# EAGLE design openautov1point2 (EAGLE 8.3.1)
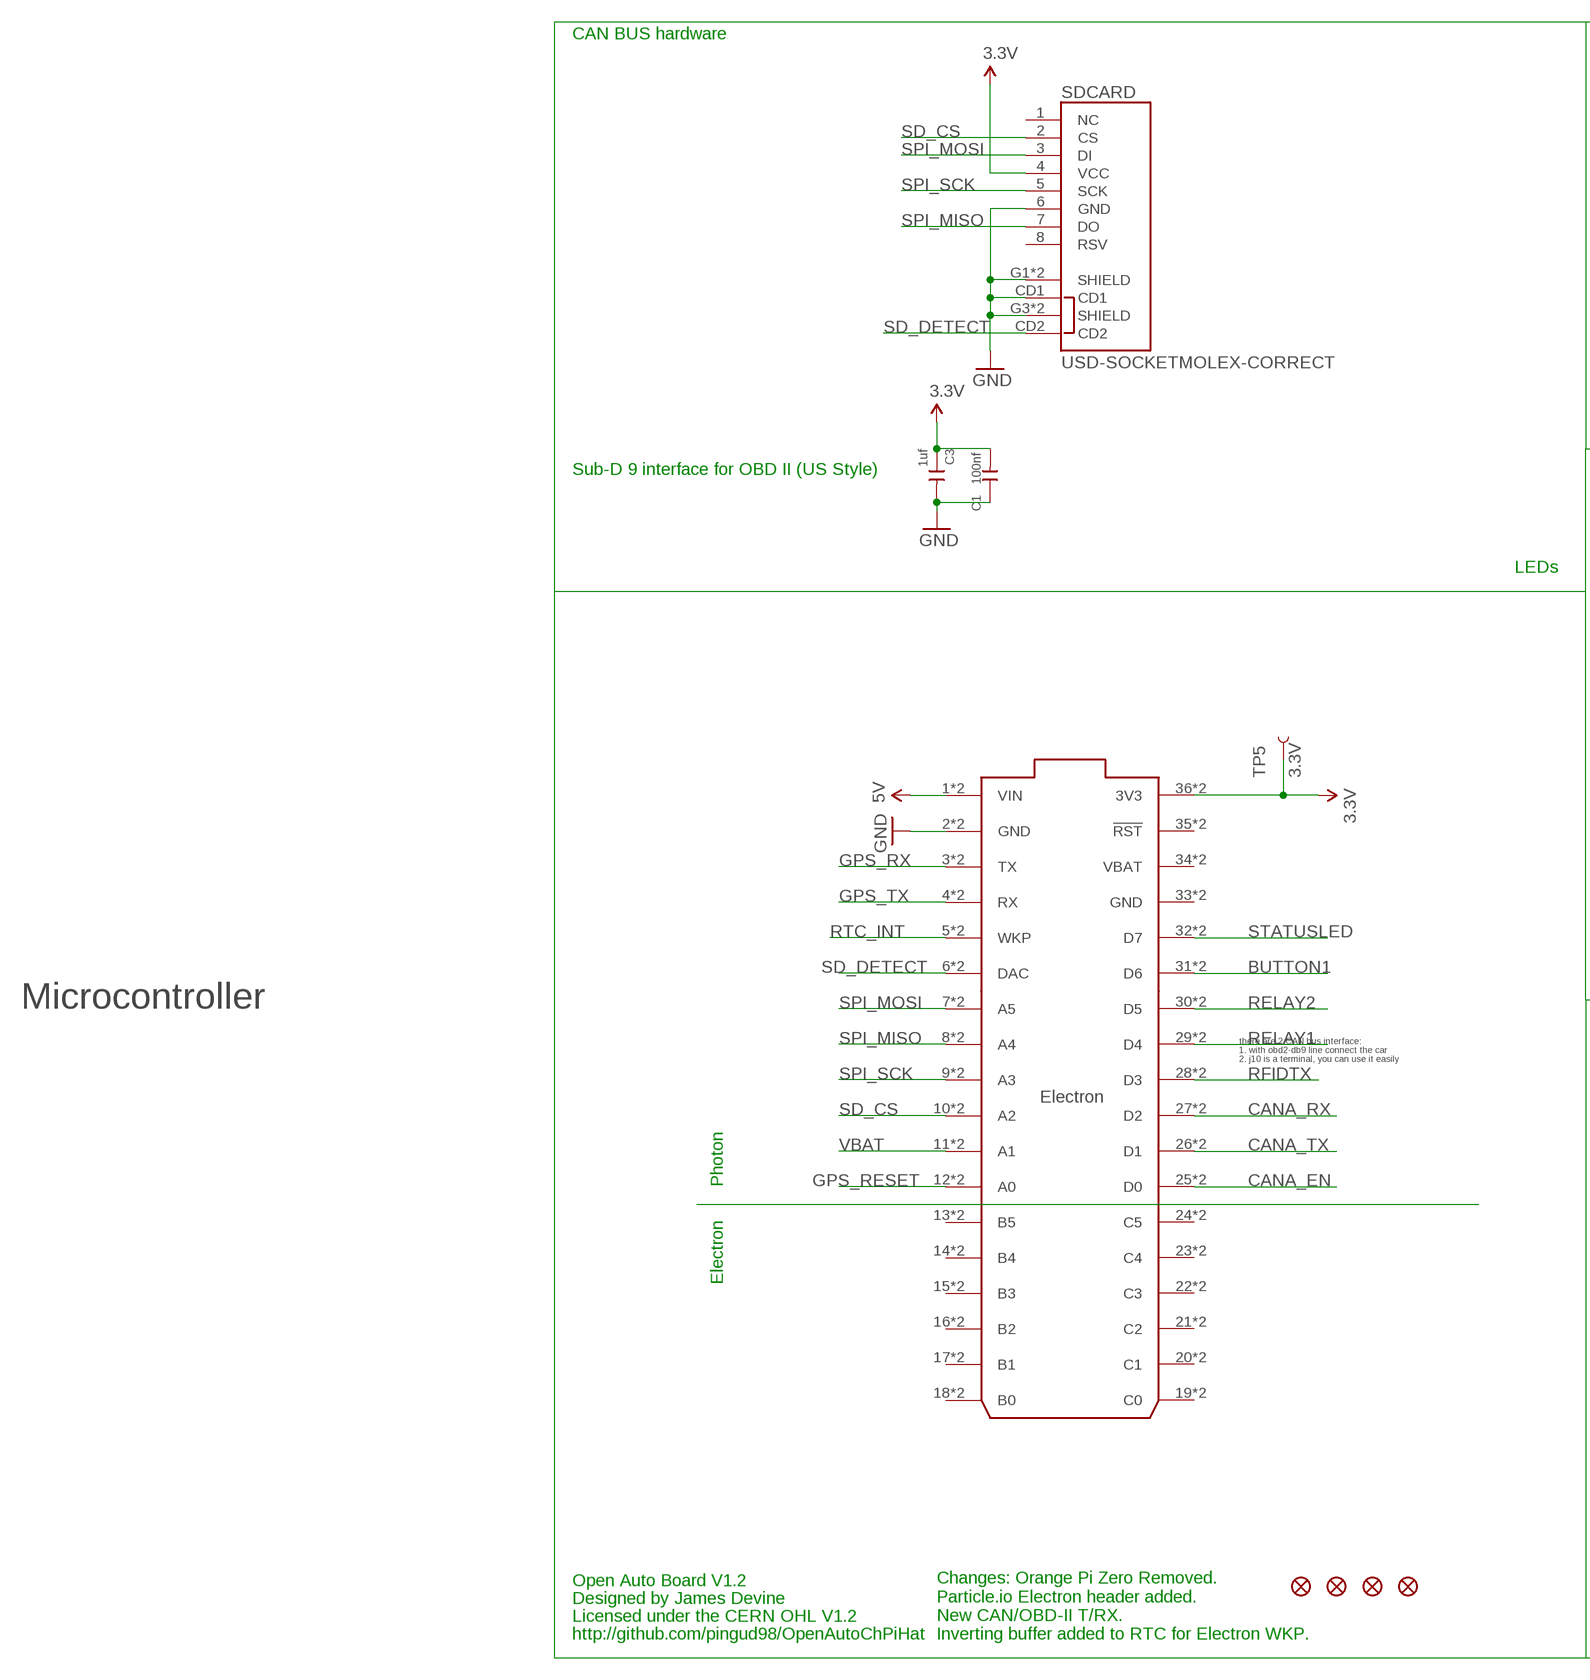
[diagram p0: schematic, sheet 1, part 1 of 2]
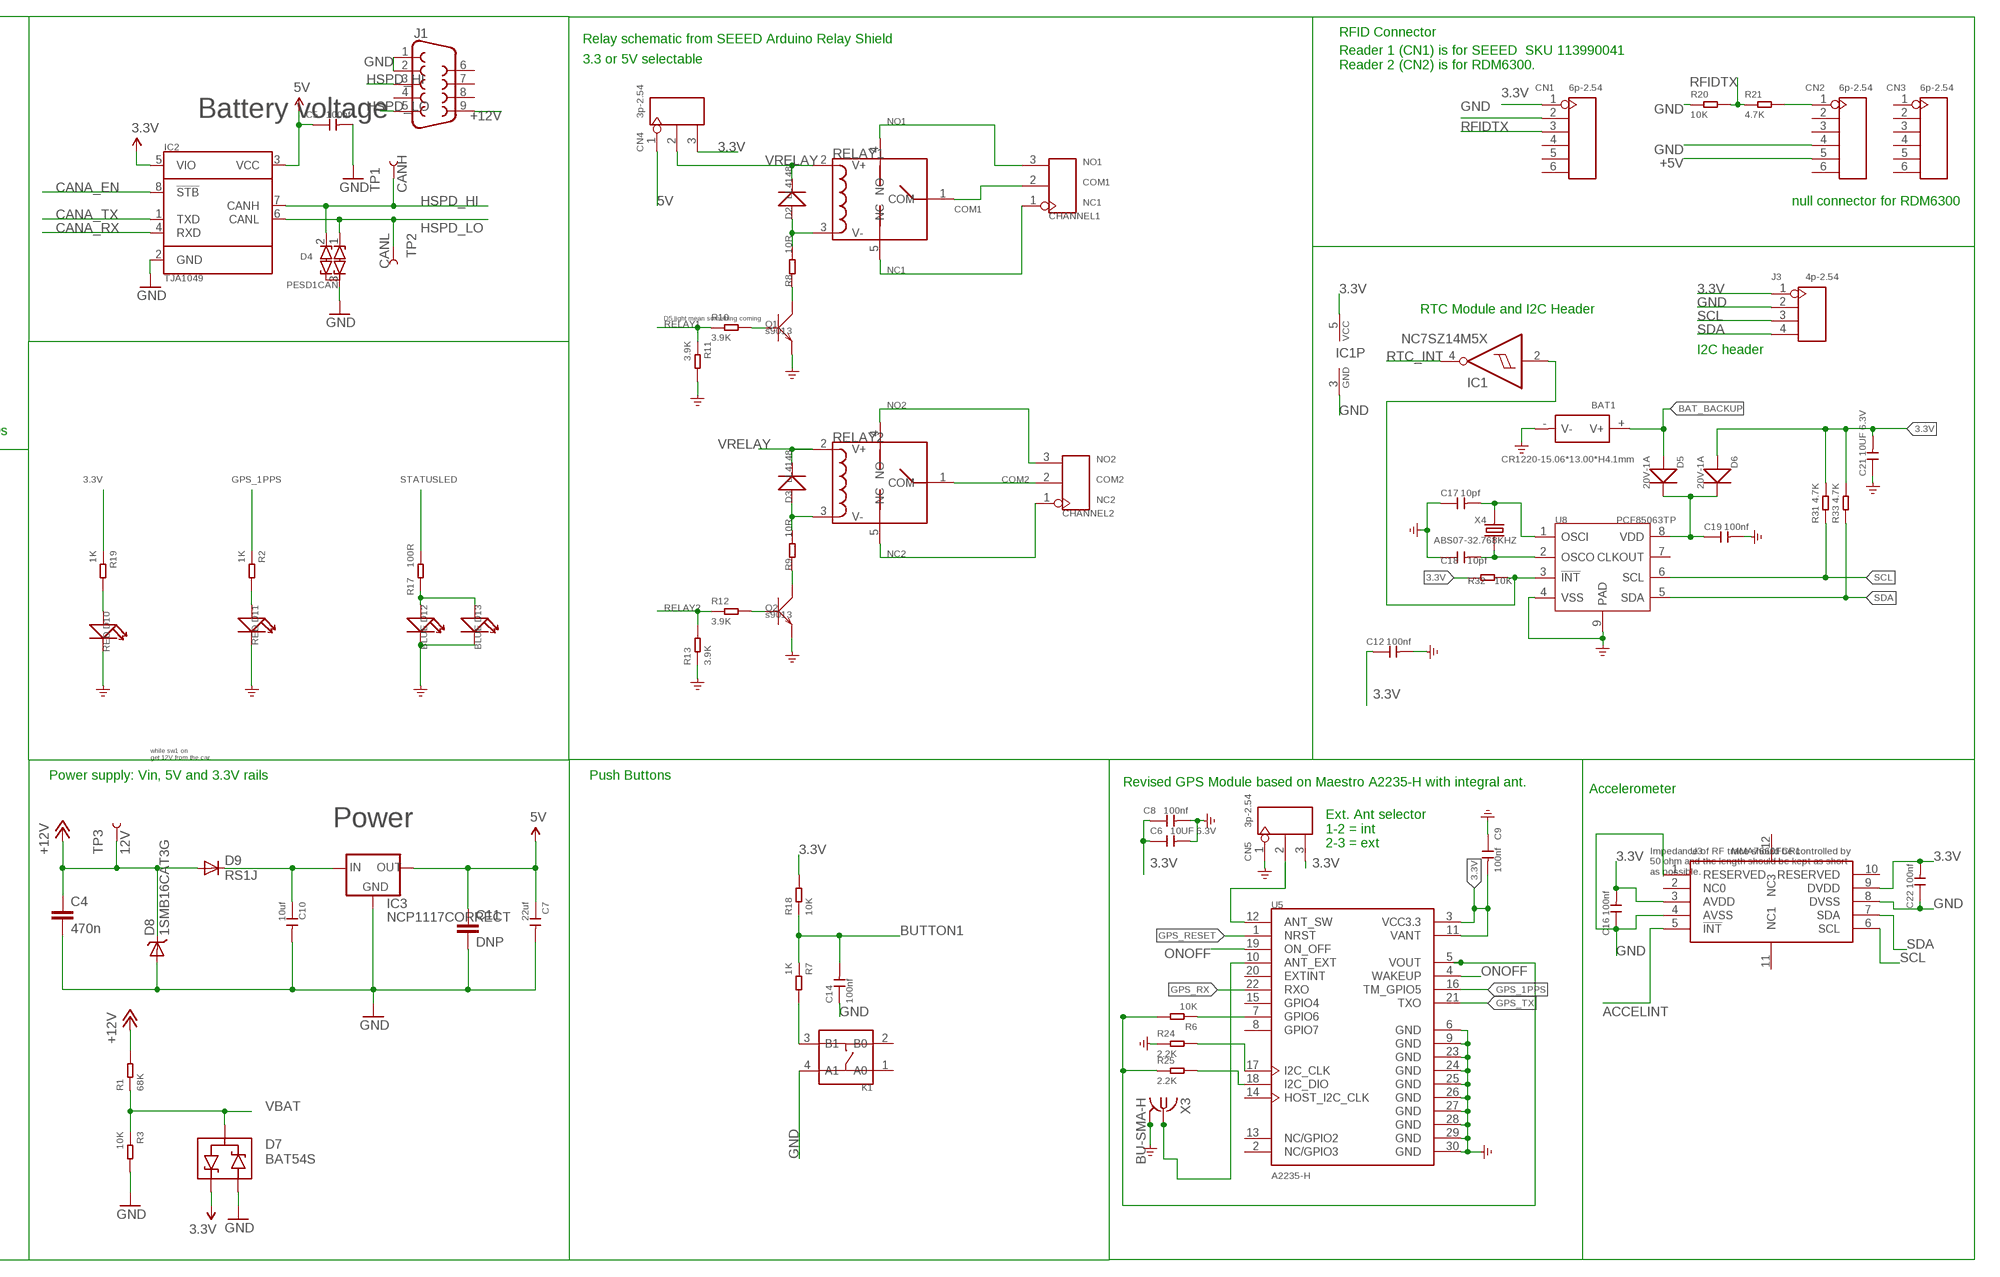
[diagram p1: schematic, sheet 1, part 2 of 2]

## Parts
BAT1  CR1220-15.06*13.00*H4.1mm  BAT-HOLDER'SMD-1220'  [BAT2P-SMD-16.4-CR1220]
C1  100nf  CERAMIC-100NF-50V-10%-X7R(0603)  [C0603]
C3  1uf  CERAMIC-1UF-25V-10%-X7R(0603)  [C0603]
C4  470n  C-EUC0805  [C0805]
C5  100nf  CERAMIC-100NF-50V-10%-X7R(0603)  [C0603]
C6  10UF 6.3V  CERAMIC-10UF-6.3V-20%-X5R(0603)  [C0603]
C7  22uf  CERAMIC-22UF-6.3V-20%-X5R(0805)  [C0805]
C8  100nf  CERAMIC-100NF-50V-10%-X7R(0603)  [C0603]
C9  100nf  CERAMIC-100NF-50V-10%-X7R(0603)  [C0603]
C10  10uf  CERAMIC-10UF-25V-10%-X5R(0805)  [C0805]
C11  DNP  C-EUC0805  [C0805]
C12  100nf  CERAMIC-100NF-50V-10%-X7R(0603)  [C0603]
C14  100nf  CERAMIC-100NF-50V-10%-X7R(0603)  [C0603]
C16  100nf  CERAMIC-100NF-50V-10%-X7R(0603)  [C0603]
C17  10pf  CERAMIC-10PF-50V-5%-NPO(0603)  [C0603]
C18  10pf  CERAMIC-10PF-50V-5%-NPO(0603)  [C0603]
C19  100nf  CERAMIC-100NF-50V-10%-X7R(0603)  [C0603]
C21  10UF 6.3V  CERAMIC-10UF-6.3V-20%-X5R(0603)  [C0603]
C22  100nf  CERAMIC-100NF-50V-10%-X7R(0603)  [C0603]
CHANNEL1  SCREW-TERMINAL-3P'3.5'  [3P-3.5]
CHANNEL2  SCREW-TERMINAL-3P'3.5'  [3P-3.5]
CN1  6p-2.54  DIP-BLACK-FEMALE-HEADER-VERT(6P-2.54)  [H6-2.54]
CN2  6p-2.54  DIP-BLACK-FEMALE-HEADER-VERT(6P-2.54)  [H6-2.54]
CN3  6p-2.54  DIP-BLACK-FEMALE-HEADER-VERT(6P-2.54)  [H6-2.54]
CN4  3p-2.54  DIP-BLACK-MALE-HEADER-VERT(3P-2.54)  [H3-2.54]
CN5  3p-2.54  DIP-BLACK-MALE-HEADER-VERT(3P-2.54)  [H3-2.54]
D2  LL4148  D'1N4148-SMD'  [LL-34]
D3  LL4148  D'1N4148-SMD'  [LL-34]
D4  PESD1CAN  DIODE_ESD_DUAL-SOT-23  [SOT23]
D5  20V-1A  SMD-DIODE-SCHOTTKY-20V-1A(SOD-123)  [SOD-123]
D6  20V-1A  SMD-DIODE-SCHOTTKY-20V-1A(SOD-123)  [SOD-123]
D7  BAT54S  [SOT23]
D8  1SMB16CAT3G  DIODE-TVS-SMB  [SMB-DIODE]
D9  RS1J  DIODESMA  [SMA-DIODE]
D10  RED  LED'0603'  [LED-0603]
D11  RED  LED'0603'  [LED-0603]
D12  BLUE  LED'0603'  [LED-0603]
D13  BLUE  LED'0603'  [LED-0603]
ELECTRON  ELECTRON_WITH_EXTERNAL_HEADERS  [ELECTRON_EXTERNAL]
FID1  FIDUCIAL1.5X3  [FIDUCIAL-1.5X3]
FID2  FIDUCIAL1.5X3  [FIDUCIAL-1.5X3]
FID3  FIDUCIAL1.5X3  [FIDUCIAL-1.5X3]
FID4  FIDUCIAL1.5X3  [FIDUCIAL-1.5X3]
IC1  NC7SZ14M5X  [SOT23-5]
IC2  TJA1049  [SO8]
IC3  NCP1117CORRECT  [SOT223]
J1  DB9MALE  [DB9_MALE]
J3  4p-2.54  DIP-BLACK-FEMALE-HEADER-VERT(4P-2.54)  [H4-2.54]
K1  DIP-SWITCH-TACTILE-SPST-NO/TS-1109(4P-D6.0MM)'TS-1109'  [SW4-6.0X6.0X5.0MM]
Q1  s9013  TRANSISTOR-NPN-SOT23  [SOT23]
Q2  s9013  TRANSISTOR-NPN-SOT23  [SOT23]
R1  68K  SMD-RES-68K-1%-1/10W(0603)  [R0603]
R2  1K  SMD-RES-1K-1%-1/10W(0603)  [R0603]
R3  10K  SMD-RES-10K-5%-1/10W(0603)  [R0603]
R6  10K  SMD-RES-10K-5%-1/10W(0603)  [R0603]
R7  1K  SMD-RES-1K-1%-1/10W(0603)  [R0603]
R8  10R  R-0603  [R0603]
R9  10R  R-0603  [R0603]
R10  3.9K  SMD-RES-3.9K-5%-1/10W(0603)  [R0603]
R11  3.9K  SMD-RES-3.9K-5%-1/10W(0603)  [R0603]
R12  3.9K  SMD-RES-3.9K-5%-1/10W(0603)  [R0603]
R13  3.9K  SMD-RES-3.9K-5%-1/10W(0603)  [R0603]
R17  100R  SMD-RES-100R-5%-1/10W(0603)  [R0603]
R18  10K  SMD-RES-10K-5%-1/10W(0603)  [R0603]
R19  1K  SMD-RES-1K-1%-1/10W(0603)  [R0603]
R20  10K  SMD-RES-10K-5%-1/10W(0603)  [R0603]
R21  4.7K  SMD-RES-4.7K-5%-1/10W(0603)  [R0603]
R24  2.2K  SMD-RES-2.2K-5%-1/10W(0603)  [R0603]
R25  2.2K  SMD-RES-2.2K-5%-1/10W(0603)  [R0603]
R31  4.7K  SMD-RES-4.7K-5%-1/10W(0603)  [R0603]
R32  10K  SMD-RES-10K-5%-1/10W(0603)  [R0603]
R33  4.7K  SMD-RES-4.7K-5%-1/10W(0603)  [R0603]
RELAY1  RELAY-HLS8L-DC5V-S-C  [5P-19.0X15.5X15.8H]
RELAY2  RELAY-HLS8L-DC5V-S-C  [5P-19.0X15.5X15.8H]
SDCARD  USD-SOCKETMOLEX-CORRECT  [MICRO-SD-MOLEX-CORRECT]
TP1  CANH  TEST-POINT3  [PAD.03X.03]
TP2  CANL  TEST-POINT3  [PAD.03X.03]
TP3  12V  TEST-POINT3  [PAD.03X.03]
TP5  3.3V  TEST-POINT3  [PAD.03X.03]
U3  MMA7660FCR1  MOTION/POSITION-MMA7660FCR1(DFN10)  [DFN10-0.5-3.0X3.0MM]
U5  A2235-H  [XCVR_A2235-H]
U8  PCF85063TP  RTC-PCF85063TP  [HWSON8-0.5-2X3X0.75MM]
X3  BU-SMA-H  [BU-SMA-H]
X4  ABS07-32.768KHZ  CRYSTAL-2P-3215  [X2-SMD-3.2X1.5X0.55MM]

## Nets
3.3V: C1.2 C3.1 C6.1 C8.1 C9.2 C12.1 C16.2 C21.2 C22.2 CN1.1 CN4.3 D6.+ D7.2(C1) ELECTRON.36(3V3) ELECTRON.@36(3V3) IC1.5(VCC) IC2.5(VIO) J3.1 R18.2 R19.1 R31.2 R32.1 R33.2 SDCARD.4(VCC) TP5.P$1 U3.3(AVDD) U3.9(DVDD) U5.3(VCC3.3) U5.11(VANT)
5V [power]: C5.1 C7.1 C11.1 CN4.1 ELECTRON.1(VIN) ELECTRON.@1(VIN) IC2.3(VCC) IC3.2(OUT) IC3.4(OUT)
!RTC_INT: IC1.2(I) R32.2 U8.3(!INT)
+5V [5V Line]: CN2.5
+12V [power]: C4.1 D8.C D9.A J1.9 R1.2 TP3.P$1
ACCELINT: U3.5(!INT)
BAT_BACKUP: BAT1.+(V+) D5.+
BUTTON1: C14.2 ELECTRON.31(D6) ELECTRON.@31(D6) R7.1 R18.1
CANA_EN: ELECTRON.25(D0) ELECTRON.@25(D0) IC2.8(!STB)
CANA_RX: ELECTRON.27(D2) ELECTRON.@27(D2) IC2.4(RXD)
CANA_TX: ELECTRON.26(D1) ELECTRON.@26(D1) IC2.1(TXD)
COM1: CHANNEL1.2 RELAY1.1(COM)
COM2: CHANNEL2.2 RELAY2.1(COM)
GND [power]: BAT1.-(V-) C1.1 C3.2 C4.2 C5.2 C6.2 C7.2 C8.2 C9.1 C10.2 C11.2 C12.2 C14.1 C16.1 C17.1 C18.1 C19.2 C21.1 C22.1 CN1.2 CN2.4 CN5.1 D4.3(COM) D7.1(A2) D8.A D10.- D11.- D12.- D13.- ELECTRON.2(GND) ELECTRON.@2(GND) IC1.3(GND) IC2.2(GND) IC3.1(GND) J1.1 J1.2 J3.2 K1.4(A1) Q1.2(E) Q2.2(E) R3.2 R11.2 R13.1 R20.1 R24.1 SDCARD.6(GND) SDCARD.CD1 SDCARD.G1(SHIELD) SDCARD.G2(SHIELD) SDCARD.G3(SHIELD) SDCARD.G4(SHIELD) U3.1(RESERVED) U3.4(AVSS) U3.8(DVSS) U5.6(GND) U5.9(GND) U5.23(GND) U5.24(GND) U5.25(GND) U5.26(GND) U5.27(GND) U5.28(GND) U5.29(GND) U5.30(GND) U8.4(VSS) U8.9(PAD) X3.2 X3.3 X3.4 X3.5 ; supply symbol labelled GND_POWER
GPS_1PPS: R2.1 U5.16(TM_GPIO5)
GPS_RESET: ELECTRON.12(A0) ELECTRON.@12(A0) U5.1(NRST)
GPS_RX: ELECTRON.3(TX) ELECTRON.@3(TX) U5.22(RXO)
GPS_TX: ELECTRON.4(RX) ELECTRON.@4(RX) U5.21(TXO)
HSPD_HI: D4.2(C2) IC2.7(CANH) J1.3 TP1.P$1
HSPD_LO: D4.1(C1) IC2.6(CANL) J1.5 TP2.P$1
N$1: K1.3(B1) R7.2
N$2: CN5.2 U5.12(ANT_SW)
N$4 [5V Line]: Q2.1(B) R12.2
N$5 [5V Line]: D3.A(+) R9.2 RELAY2.3(V-)
N$6 [5V Line]: Q1.3(C) R8.1
N$7 [5V Line]: D2.A(+) R8.2 RELAY1.3(V-)
N$8 [5V Line]: Q2.3(C) R9.1
N$9: D11.+ R2.2
N$10: D12.+ D13.+ R17.2
N$19: U5.10(ANT_EXT) X3.1
N$21: R6.2 R25.1 U5.5(VOUT)
N$22: R6.1 U5.7(GPIO6)
N$23 [5V Line]: Q1.1(B) R10.2
N$24: CN2.1 R21.2
N$26: R24.2 U5.17(I2C_CLK)
N$27: R25.2 U5.18(I2C_DIO)
N$29: D10.+ R19.2
N$40: C18.2 U8.2(OSCO) X4.1
N$41: C17.2 U8.1(OSCI) X4.2
N$43 [power]: C10.1 D9.C IC3.3(IN)
N$49: C19.1 D5.- D6.- U8.8(VDD)
NC1: CHANNEL1.1 RELAY1.5(NC)
NC2: CHANNEL2.1 RELAY2.5(NC)
NO1: CHANNEL1.3 RELAY1.4(NO)
NO2: CHANNEL2.3 RELAY2.4(NO)
ONOFF: U5.4(WAKEUP) U5.19(ON_OFF)
RELAY1 [5V Line]: ELECTRON.29(D4) ELECTRON.@29(D4) R10.1 R11.1
RELAY2: ELECTRON.30(D5) ELECTRON.@30(D5) R12.1 R13.2
RFIDTX: CN1.3 ELECTRON.28(D3) ELECTRON.@28(D3) R20.2 R21.1
RTC_INT: ELECTRON.5(WKP) ELECTRON.@5(WKP) IC1.4(O)
SCL: J3.3 R31.1 U3.6(SCL) U8.6(SCL)
SD_CS: ELECTRON.10(A2) ELECTRON.@10(A2) SDCARD.2(CS)
SD_DETECT: ELECTRON.6(DAC) ELECTRON.@6(DAC) SDCARD.CD2
SDA: J3.4 R33.1 U3.7(SDA) U8.5(SDA)
SPI_MISO: ELECTRON.8(A4) ELECTRON.@8(A4) SDCARD.7(DO)
SPI_MOSI: ELECTRON.7(A5) ELECTRON.@7(A5) SDCARD.3(DI)
SPI_SCK: ELECTRON.9(A3) ELECTRON.@9(A3) SDCARD.5(SCK)
STATUSLED: ELECTRON.32(D7) ELECTRON.@32(D7) R17.1
VBAT: D7.3(COM) ELECTRON.11(A1) ELECTRON.@11(A1) R1.1 R3.1
VRELAY: CN4.2 D2.C(-) D3.C(-) RELAY1.2(V+) RELAY2.2(V+)
Unconnected: CN1.4 CN1.5 CN1.6 CN2.2 CN2.3 CN2.6 CN3.1 CN3.2 CN3.3 CN3.4 CN3.5 CN3.6 CN5.3 ELECTRON.13(B5) ELECTRON.14(B4) ELECTRON.15(B3) ELECTRON.16(B2) ELECTRON.17(B1) ELECTRON.18(B0) ELECTRON.19(C0) ELECTRON.20(C1) ELECTRON.21(C2) ELECTRON.22(C3) ELECTRON.23(C4) ELECTRON.24(C5) ELECTRON.35(!RST) ELECTRON.@13(B5) ELECTRON.@14(B4) ELECTRON.@15(B3) ELECTRON.@16(B2) ELECTRON.@17(B1) ELECTRON.@18(B0) ELECTRON.@19(C0) ELECTRON.@20(C1) ELECTRON.@21(C2) ELECTRON.@22(C3) ELECTRON.@23(C4) ELECTRON.@24(C5) ELECTRON.@35(!RST) J1.4 J1.6 J1.7 J1.8 K1.1(A0) K1.2(B0) SDCARD.1(NC) SDCARD.8(RSV) U3.2(NC0) U3.10(RESERVED) U3.11(NC1) U3.12(NC3) U5.2(NC/GPIO3) U5.8(GPIO7) U5.13(NC/GPIO2) U5.14(HOST_I2C_CLK) U5.15(GPIO4) U5.20(EXTINT) U8.7(CLKOUT)

## Notes on the sheet
- CAN BUS hardware
- RFID Connector
- Relay schematic from SEEED Arduino Relay Shield
- 3.3 or 5V selectable
- Reader 1 (CN1) is for SEEED  SKU 113990041
  Reader 2 (CN2) is for RDM6300.
- Battery voltage
- null connector for RDM6300
- RTC Module and I2C Header
- D5 light mean something coming
- I2C header
- Sub-D 9 interface for OBD II (US Style)
- LEDs
- while sw1 on
- get 12V from the car,
- Microcontroller
- Power supply: Vin, 5V and 3.3V rails | Push Buttons
- Revised GPS Module based on Maestro A2235-H with integral ant.
- there are 2 CAN bus interface: | Accelerometer
- 1. with obd2-db9 line connect the car
- 2. j10 is a terminal, you can use it easily
- Power
- Ext. Ant selector
  1-2 = int
  2-3 = ext
- Impedance of RF trace should be controlled by 
  50 ohm and the length should be kept as short 
  as possible.
- Photon
- Electron
- short route
- Open Auto Board V1.2
- Designed by James Devine
- Licensed under the CERN OHL V1.2
- http://github.com/pingud98/OpenAutoChPiHat
- Changes: Orange Pi Zero Removed.
  Particle.io Electron header added.
  New CAN/OBD-II T/RX.
  Inverting buffer added to RTC for Electron WKP.

## Power pins joined to a net without a drawn wire
GND: ELECTRON.33(GND) ELECTRON.@33(GND)
VBAT: ELECTRON.34(VBAT) ELECTRON.@34(VBAT)

## Library data of the parts
BAT1 = Connector-new:BAT-HOLDER: BAT2P-13.5-CR1220:320170002;BAT2P-SMD-20.5-CR1632:320170007;METAL-CR2032-D20.0*H6.3MM:320170003;METAL-CR2032-SMD:320170006;PLASTIC-CR1220-L15.06*W13.0*H4.1MM:320170000;PLASTIC-CR2032-L25.2*W15.6*H5.2MM:320170005;BAT2P-11.55-D12.55-CR1220:313010022
C1 C5 C8 C9 C12 C14 C16 C19 C22 = Seeed-Capacitor:CERAMIC-100NF-50V-10%-X7R(0603): 302010138; MPN: CC0603KRX7R9BB104
C3 = Seeed-Capacitor:CERAMIC-1UF-25V-10%-X7R(0603): 302010139; MPN: CC0603KRX7R8BB105; PARTNO: CC0805KKX7R7BB105
C4 = rcl:C-EU: CAPACITOR, European symbol; PARTNO: C0805C474K5RACTU
C6 C21 = Seeed-Capacitor:CERAMIC-10UF-6.3V-20%-X5R(0603): 302010286; MPN: CC0603MRX5R5BB106
C7 = Seeed-Capacitor:CERAMIC-22UF-6.3V-20%-X5R(0805): 302010171; MPN: CC0805MKX5R5BB226; PARTNO: GRM219R61A226MEA0D
C10 = Seeed-Capacitor:CERAMIC-10UF-25V-10%-X5R(0805): 302010178; MPN: CC0805KKX5R8BB106; PARTNO: GRM21BR6YA106KE43L
C11 = rcl:C-EU: CAPACITOR, European symbol; PARTNO: GRM219R61A226MEA0D
C17 C18 = Seeed-Capacitor:CERAMIC-10PF-50V-5%-NPO(0603): 302010097; MPN: CC0603JRNPO9BN100
CHANNEL1 CHANNEL2 = Connector :SCREW-TERMINAL-3P
CN1-CN3 = Seeed-Connector:DIP-BLACK-FEMALE-HEADER-VERT(6P-2.54): 320030060; MPN: F185-1106A1BSYC1
CN4 CN5 = Seeed-Connector:DIP-BLACK-MALE-HEADER-VERT(3P-2.54): 320020079
D2 D3 = discrete:D*
D4 = MuniRent:DIODE_ESD_DUAL: Dual ESD Diode, with a common anode; PARTNO: PESD1CAN-215
D5 D6 = Seeed-Diode:SMD-DIODE-SCHOTTKY-20V-1A(SOD-123): 304020034; MPN: B5819W
D7 = MuniRent:BAT54S; PARTNO: BAT54S-7-F
D8 = BUG:DIODE-TVS; PARTNO: 1SMB16CAT3G; ROLE: Overvoltage protection
D9 = BUG:DIODE: Diode These are standard reverse protection diodes and small signal diodes. SMA package can handle up to about 1A. SOD-323 can handle about 200mA. What the SOD-323 package when ordering, there are some mfgs out there that are 5-pin packages.; PARTNO: RS1J-E3/5AT; ROLE: Reverse protection
D10-D13 = Discrete:LED*
ELECTRON = MuniRent:ELECTRON; PARTNO: PPTC181LFBN-RC
FID1-FID4 = SparkFun-Retired:FIDUCIAL: Fiducial Alignment Points Various fiducial points for machine vision alignment.
IC1 = 74xx-little-us:NC7SZ14: TinyLogic(R) UHS Inverter with Schmitt Trigger Input Source: http://www.fairchildsemi.com/ds/NC/NC7SZ14.pdf
IC2 = MuniRent:TJA1049; PARTNO: TJA1049T-118
IC3 = MuniRent:NCP1117; PARTNO: NCP1117LPST50T3G
J1 = SparkFun-Connectors:DB9: DB9 Connector Standard DB9 (D-Sub 9) serial connector. Can be used for CAN bus as well as RS485 and RS232. Footprint production proven. Here is the female version connector we sell at SparkFun: 9 Pin Female Serial Connector - PCB Mount <https://www.sparkfun.com/products/429> (PRT-00429) This connector has been used on the following SparkFun products: SparkFun RS232 Shifter - SMD <https://www.sparkfun.com/products/449> (PRT-00449) SparkFun RS232 Shifter SMD (No DB9) <https://www.sparkfun.com/products/8780> (PRT-08780); PROD_ID: CONN-09904
J3 = Seeed-Connector:DIP-BLACK-FEMALE-HEADER-VERT(4P-2.54): 320030017; MPN: F185-1104A1BSYA1
K1 = Seeed-Switch:DIP-SWITCH-TACTILE-SPST-NO/TS-1109(4P-D6.0MM): 311020024
Q1 Q2 = discrete:TRANSISTOR-NPN*: NPN audion
R1 = Seeed-Resistor:SMD-RES-68K-1%-1/10W(0603): 301010169; MPN: RC0603FR-0768KL; PARTNO: ERJ-6ENF6202V
R2 R7 R19 = Seeed-Resistor:SMD-RES-1K-1%-1/10W(0603): 301010298; MPN: RC0603FR-071KL
R3 R6 R18 R20 R32 = Seeed-Resistor:SMD-RES-10K-5%-1/10W(0603): 301010293; MPN: RC0603JR-0710KL; VALUE: 10K 1/10W
R8 R9 = discrete:R*
R10-R13 = Seeed-Resistor:SMD-RES-3.9K-5%-1/10W(0603): 301010101; MPN: RC0603JR-073K9L
R17 = Seeed-Resistor:SMD-RES-100R-5%-1/10W(0603): 301010090; MPN: RC0603JR-07100RL
R21 R31 R33 = Seeed-Resistor:SMD-RES-4.7K-5%-1/10W(0603): 301010290; MPN: RC0603JR-074K7L
R24 R25 = Seeed-Resistor:SMD-RES-2.2K-5%-1/10W(0603): 301010124; MPN: RC0603JR-072K2L
RELAY1 RELAY2 = discrete:RELAY-HLS8L-DC5V-S-C
SDCARD = MuniRent:USD-SOCKET: microSD Socket Push-push type uSD socket. Schematic element and footprint production proven. Spark Fun Electronics SKU : PRT-00127. tDoc lines correctly indicate media card edge positions when inserting (unlocked, locked, depressed). NOTE: CD1 and CD2 are connected internally; PARTNO: 1040310811
TP1-TP3 TP5 = SparkFun-Passives:TEST-POINT: Bare copper test points for troubleshooting or ICT; BOM: EXCLUDE
U3 = Seeed-Sensor:MOTION/POSITION-MMA7660FCR1(DFN10): 314080009; MPN: MMA7660FCR1
U5 = A2235-H:A2235-H: Gps Module, Mini Outline w/ Ant; AVAILABILITY: Good; DESCRIPTION: Gps Module, Mini Outline w/ Ant; MF: Maestro Wireless; MP: A2235H; PACKAGE: None; PRICE: 15.93 USD
U8 = IC-new:RTC-PCF85063TP
X3 = con-coax:BU-SMA-H: FEMALE SMA CONNECTOR Radiall; OC_FARNELL: unknown; OC_NEWARK: unknown
X4 = Discrete-new:CRYSTAL-2P

## Net classes
0 default: width 0.152 mm, clearance 0.152 mm
1 power: width 0.152 mm, clearance 0.152 mm
2 5V Line: width 0.152 mm, drill 0.152 mm, clearance 0.152 mm

## Board
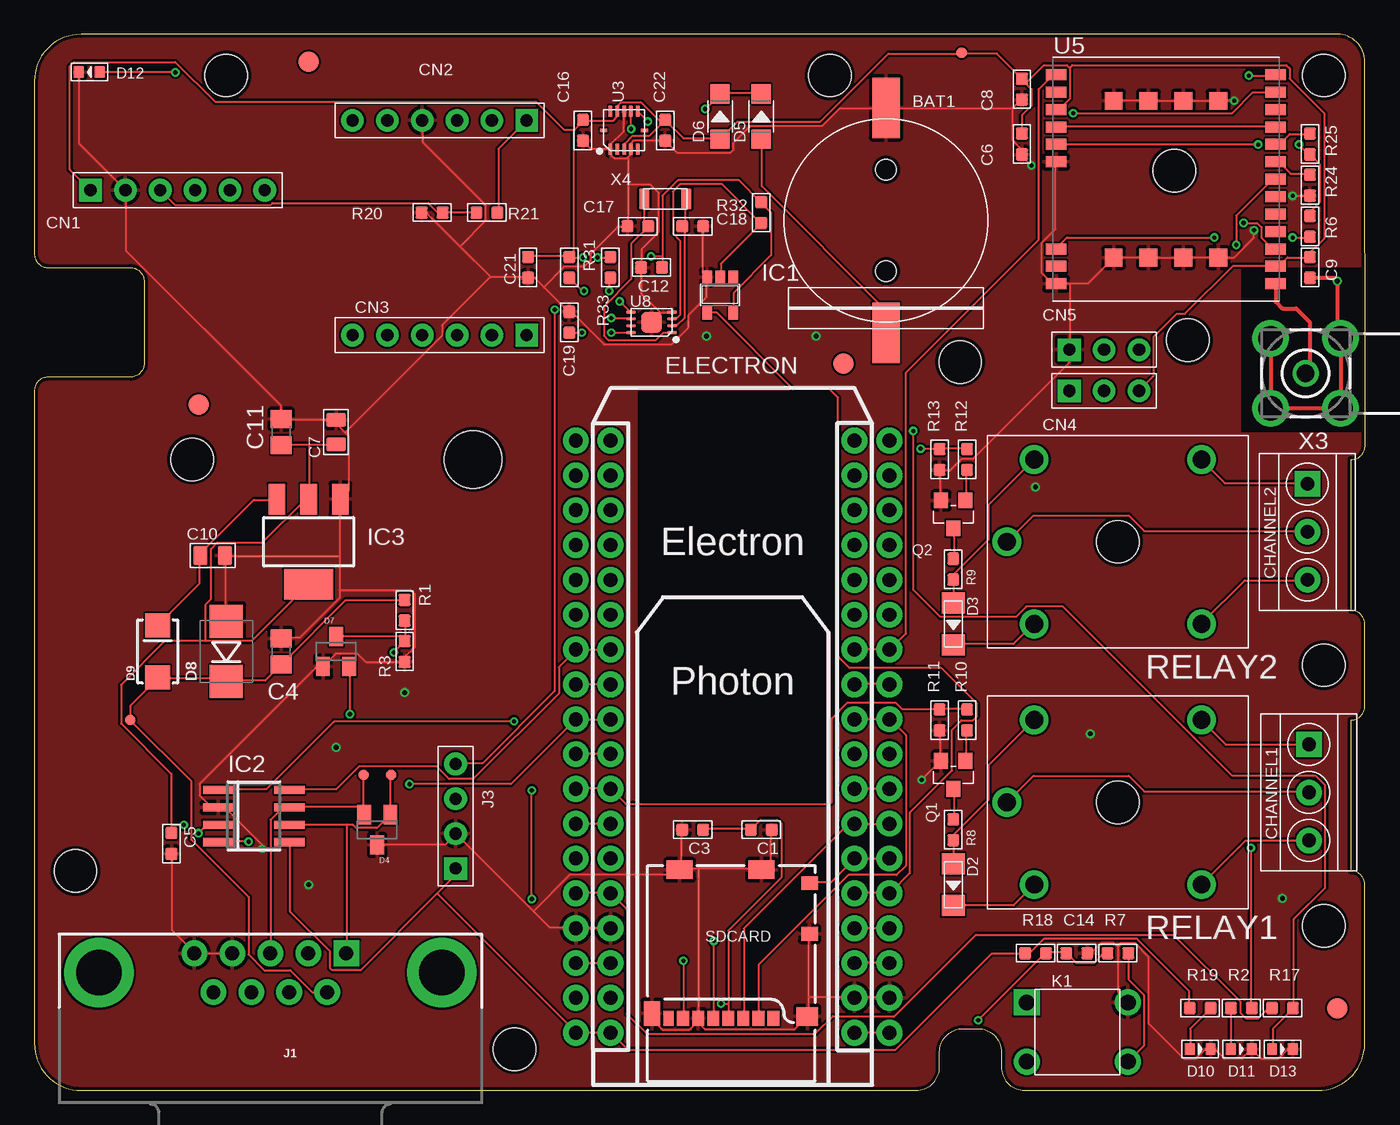
[diagram p2: board, top side]
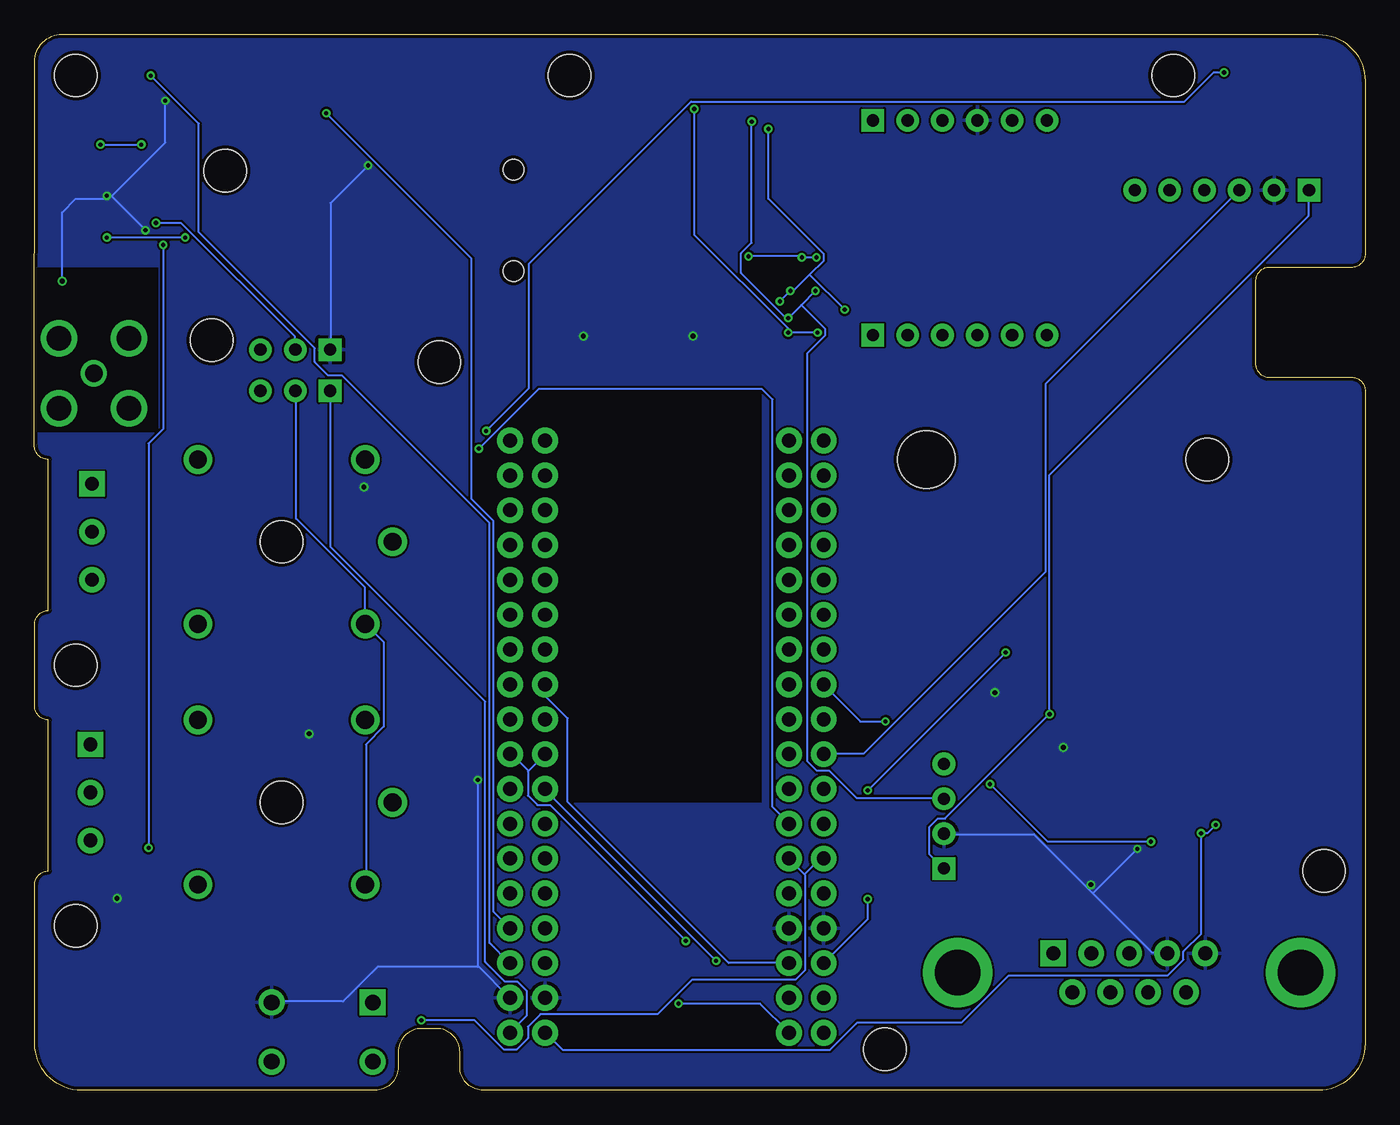
[diagram p3: board, bottom side, seen from below]

Size 97.03 x 77 mm. Coordinates in mm from the lower left corner, seen from the top.
Outline: 7,52 1,52 arc90 0,51 0,3.41 arc90 3.41,0 64.29,0 arc90 66,1.71 66,2.79 arc-90 67.71,4.5 68.79,4.5 arc-90 70.5,2.79 70.5,1.71 arc90 72.21,0 93.59,0 arc90 97,3.41 97,15 arc90 96,16 96,27 arc90 97,28 97,34 arc90 96,35 96,46 arc90 97.03,47.03 97,75 arc90 95,77 3.41,77 arc90 0,73.59 0,61 arc90 1,60 7,60 arc-90 8,59 8,53 arc-90 7,52
Copper layers (1*16): Top 0.035mm / dielectric 1.5mm / Bottom 0.035mm
Design rules "SeeedStudio_2layer_DRU_no_angle_20140221": minimum track width 6mil, minimum drill 12mil, track to track 6mil, track to pad 6mil, pad to pad 6mil, via to via 6mil, smd to smd 0mil, copper to edge 10mil, drill to drill 10mil, minimum pad ring 10mil, minimum via ring 6mil, stop-mask expansion 2mil, vias tented up to drill 100mil, thermal gap 10mil
Holes 3.1 mm at 14,74 3,16 94,12 94,31 94,74 58,74 84.1,54.7 67.5,53.1 79,21 79,40 35,3 11.5,46
Holes 4.2 mm at 32,46
tRestrict: area 44,21 to 58,51; area 88,48 to 98,60
bRestrict: area 44,21 to 58,51; area 88,48 to 98,60

### Footprints (pad centres in the part's own frame; a part is rotated, then mirrored left to right if it is on the bottom)
BAT2P-SMD-16.4-CR1220 = smd 2 x 4.4: + 0,-8.2; - 0,8.2 | hole 1.5: 0,3.7; 0,-3.7
C0603 = smd 0.889 x 0.889: 1 0,0.762; 2 0,-0.762
C0805 = smd 1.3 x 1.5: 1 -0.95,0; 2 0.95,0
C0805' = smd 1.397 x 1.016: 1 0,0.889; 2 0,-0.889
3P-3.5 = drill 1 pad 1.85 square: 1 0,-3.5 | drill 1 pad 1.85: 2 0,0; 3 0,3.5
H6-2.54 = drill 0.889 pad 1.651 square: 1 0,6.35 | drill 0.889 pad 1.651: 2 0,3.81; 3 0,1.27; 4 0,-1.27; 5 0,-3.81; 6 0,-6.35
H3-2.54 = drill 0.889 pad 1.651 square: 1 0,2.54 | drill 0.889 pad 1.651: 2 0,0; 3 0,-2.54
LL-34 = smd 1.524 x 1.676: A -1.524,0; C 1.524,0
SOT23 = smd 1 x 1.4: 1 -0.95,-1.1; 2 0.95,-1.1; 3 0,1.1
SOD-123 = smd 1.397 x 1.397: + -1.651,0; - 1.651,0
SMB-DIODE = smd 2.4 x 2.4: A 2.2,0; C -2.2,0
SMA-DIODE = smd 1.75 x 1.8: A -1.91,0; C 1.91,0
LED-0603 = smd 0.762 x 0.889: + -0.762,0; - 0.762,0
ELECTRON_EXTERNAL = drill 1.016 pad 1.88: 1 1.27,46.99; 2 1.27,44.45; 3 1.27,41.91; 4 1.27,39.37; 5 1.27,36.83; 6 1.27,34.29; 7 1.27,31.75; 8 1.27,29.21; 9 1.27,26.67; 10 1.27,24.13; 11 1.27,21.59; 12 1.27,19.05; 13 1.27,16.51; 14 1.27,13.97; 15 1.27,11.43; 16 1.27,8.89; 17 1.27,6.35; 18 1.27,3.81; 19 19.05,3.81; 20 19.05,6.35; 21 19.05,8.89; 22 19.05,11.43; 23 19.05,13.97; 24 19.05,16.51; 25 19.05,19.05; 26 19.05,21.59; 27 19.05,24.13; 28 19.05,26.67; 29 19.05,29.21; 30 19.05,31.75; 31 19.05,34.29; 32 19.05,36.83; 33 19.05,39.37; 34 19.05,41.91; 35 19.05,44.45; 36 19.05,46.99; @1 -1.27,46.99; @2 -1.27,44.45; @3 -1.27,41.91; @4 -1.27,39.37; @5 -1.27,36.83; @6 -1.27,34.29; @7 -1.27,31.75; @8 -1.27,29.21; @9 -1.27,26.67; @10 -1.27,24.13; @11 -1.27,21.59; @12 -1.27,19.05; @13 -1.27,16.51; @14 -1.27,13.97; @15 -1.27,11.43; @16 -1.27,8.89; @17 -1.27,6.35; @18 -1.27,3.81; @19 21.59,3.81; @20 21.59,6.35; @21 21.59,8.89; @22 21.59,11.43; @23 21.59,13.97; @24 21.59,16.51; @25 21.59,19.05; @26 21.59,21.59; @27 21.59,24.13; @28 21.59,26.67; @29 21.59,29.21; @30 21.59,31.75; @31 21.59,34.29; @32 21.59,36.83; @33 21.59,39.37; @34 21.59,41.91; @35 21.59,44.45; @36 21.59,46.99
FIDUCIAL-1.5X3 = smd 1.5 x 1.5: 1 0,0
SOT23-5 = smd 0.69 x 0.99: 1 -0.95,-1.29; 2 0,-1.29; 3 0.95,-1.29; 4 0.95,1.3; 5 -0.95,1.3
SO8 = smd 0.6 x 2.2: 1 -1.905,-2.6; 2 -0.635,-2.6; 3 0.635,-2.6; 4 1.905,-2.6; 5 1.905,2.6; 6 0.635,2.6; 7 -0.635,2.6; 8 -1.905,2.6
SOT223 = smd 1.219 x 2.235: 1 -2.311,-3.099; 2 0,-3.099; 3 2.311,-3.099 | smd 3.6 x 2.2: 4 0,3.099
DB9_MALE = drill 1.016 pad 1.88: 1 5.54,-1.42; 2 2.77,-1.42; 3 0,-1.42; 4 -2.77,-1.42; 6 4.15,1.42; 7 1.38,1.42; 8 -1.38,1.42; 9 -4.15,1.42 | drill 1.016 pad 1.88 square: 5 -5.54,-1.42 | drill 3.302 pad 5.08: G1 -12.5,0; G2 12.5,0
H4-2.54 = drill 0.889 pad 1.651 square: 1 0,3.81 | drill 0.889 pad 1.651: 2 0,1.27; 3 0,-1.27; 4 0,-3.81
SW4-6.0X6.0X5.0MM = drill 1.143 pad 1.905 square: 1 -3.683,2.159 | drill 1.143 pad 1.905: 2 -3.683,-2.159; 3 3.683,-2.159; 4 3.683,2.159
SOT23' = smd 1.016 x 1.143: 1 -0.889,-1.016; 2 0.889,-1.016; 3 0,1.016
R0603 = smd 0.889 x 0.889: 1 0,0.762; 2 0,-0.762
R0603' = smd 0.889 x 0.889: 1 -0.762,0; 2 0.762,0
5P-19.0X15.5X15.8H = drill 1.3 pad 2.1: 1 -8.1,0; 2 -6.1,-6; 3 -6.1,6; 4 6.1,-6; 5 6.1,6
MICRO-SD-MOLEX-CORRECT = smd 0.85 x 1.1: 1 3.105,0.25; 2 2.005,0.25; 3 0.905,0.25; 4 -0.195,0.25; 5 -1.295,0.25; 6 -2.395,0.25; 7 -3.495,0.25 | smd 0.75 x 1.1: 8 -4.545,0.25 | smd 1.2 x 1: CD1 5.74,6.4; CD2 5.74,10.1 | smd 1.55 x 1.35: G1 5.565,0.375 | smd 1.17 x 1.8: G2 -5.755,0.6 | smd 1.9 x 1.35: G3 -3.735,11.075; G4 2.235,11.075
PAD.03X.03 = smd 0.762 x 0.762: P$1 0,0
DFN10-0.5-3.0X3.0MM = smd 0.8 x 0.25: 1 -1.375,1; 2 -1.375,0.5; 3 -1.375,0; 4 -1.375,-0.5; 5 -1.375,-1; 6 1.375,-1; 7 1.375,-0.5; 8 1.375,0; 9 1.375,0.5; 10 1.375,1 | smd 0.25 x 0.5: 11 0,-1.5; 12 0,1.5
XCVR_A2235-H = smd 1.5 x 0.8: 1 -8,7.62; 2 -8,6.35; 3 -8,5.08; 4 -8,3.81; 5 -8,2.54; 6 -8,1.27; 7 -8,-5.08; 8 -8,-6.35; 9 -8,-7.62; 10 8,-7.62; 11 8,-6.35; 12 8,-5.08; 13 8,-3.81; 14 8,-2.54; 15 8,-1.27; 16 8,0; 17 8,1.27; 18 8,2.54; 19 8,3.81; 20 8,5.08; 21 8,6.35; 22 8,7.62 | smd 1.3 x 1.3: 23 -3.81,5.715; 24 -1.27,5.715; 25 1.27,5.715; 26 3.81,5.715; 27 -3.81,-5.715; 28 -1.27,-5.715; 29 1.27,-5.715; 30 3.81,-5.715 | hole 3.1: 0.605,0.63
HWSON8-0.5-2X3X0.75MM = smd 0.25 x 0.7: 1 -0.75,-1.5; 2 -0.25,-1.5; 3 0.25,-1.5; 4 0.75,-1.5; 5 0.75,1.5; 6 0.25,1.5; 7 -0.25,1.5; 8 -0.75,1.5 | smd 1.5 x 1.5: 9 0,0
BU-SMA-H = drill 1.27: 1 0,0 | drill 1.778: 2 -2.55,2.55; 3 2.55,2.55; 4 2.55,-2.55; 5 -2.55,-2.55
X2-SMD-3.2X1.5X0.55MM = smd 0.762 x 1.524: 1 -1.524,0; 2 1.524,0

### Placement (x,y rotation side)
BAT1  62.1,63.43 0 top
C1  53,19 270 top
C3  48,19 270 top
C4  18,32 90 top
C5  10,18 0 top
C6  72,69 0 top
C7  22uf  [C0805']  22,48 180 top
C8  72,73 0 top
C9  93,60 180 top
C10  10uf  [C0805']  13,39 90 top
C11  18,48 90 top
C12  45,60 270 top
C14  76,10 270 top
C16  40,70 180 top
C17  44,63 90 top
C18  48,63 270 top
C19  39,56 180 top
C21  36,60 180 top
C22  46,70 180 top
CHANNEL1  92.93,21.72 180 top
CHANNEL2  92.82,40.72 180 top
CN1  10.45,65.63 90 top
CN2  29.55,70.72 270 top
CN3  29.55,55.07 270 top
CN4  78,51 90 top
CN5  78,54 90 top
D2  67,15 270 top
D3  67,34 270 top
D4  25,19 180 top
D5  53,71 90 top
D6  50,71 90 top
D7  22,32 0 top
D8  14,32 90 top
D9  9,32 90 top
D10  85,3 0 top
D11  88,3 0 top
D12  4.01,74.24 180 top
D13  91,3 0 top
ELECTRON  61.07,51.19 180 top
FID1  12,50 0 top
FID2  95,6 0 top
FID3  59,53 0 top
FID4  20,75 0 top
IC1  50,58 180 top
IC2  16,20 270 top
IC3  20,40 180 top
J1  17.21,8.58 180 top
J3  30.71,19.99 180 top
K1  76.04,4.25 0 top
Q1  s9013  [SOT23']  67,23 180 top
Q2  s9013  [SOT23']  67,42 180 top
R1  27,35 180 top
R2  88,6 270 top
R3  27,32 0 top
R6  93,63 180 top
R7  79,10 90 top
R8  10R  [R0603']  67,19 270 top
R9  10R  [R0603']  67,38 270 top
R10  68,27 0 top
R11  66,27 0 top
R12  68,46 0 top
R13  66,46 180 top
R17  91,6 90 top
R18  73,10 270 top
R19  85,6 90 top
R20  29,64 90 top
R21  33,64 90 top
R24  93,66 180 top
R25  93,69 180 top
R31  39,60 180 top
R32  53,64 0 top
R33  42,60 180 top
RELAY1  79,21 0 top
RELAY2  79,40 0 top
SDCARD  50.79,5.01 0 top
TP1  24,23 0 top
TP2  26,23 0 top
TP3  7,27 0 top
TP5  67.61,75.65 0 top
U3  43,70 90 top
U5  82.5,66.43 0 top
U8  45,56 90 top
X3  92.69,52.28 0 top
X4  46,65 180 top

### Tracks (layer width: path | path; a pad name or v marks a point on that pad's centre or on a via)
3.3V  (via drill 0.3)
  Top 0.152: CN4.3 80.54,51.05 81.61,52.12 81.61,54.94 83.29,56.62 83.9,56.62 87.4,60.12 90.45,60.12 U5.11 90.53,60.12 90.75,60.12 91.36,60.73 92.96,60.73 C9.2 93.04,60.81 93.04,61.11 94.03,62.1 94.03,71.25 91.52,73.76 91.52,74.52 91.29,74.75 75.67,74.75 75.48,74.56 | 45.8,60.81 45.8,65.23 46.94,66.37 51.36,66.37 52.96,64.77 R32.1 53.03,64.69 53.72,64.01 53.72,60.88 50.98,58.14 50.98,56.77 IC1.5 | 45.8,60.81 45.8,60.05 C12.1 | C8.1 71.93,73.84 70.18,75.59 67.67,75.59 TP5.P$1 67.59,75.59 62.26,75.59 57.3,70.64 51.28,70.64 50.06,69.42 D6.+ 49.99,69.42 47.32,69.42 46.02,70.71 C22.2 | C6.1 72.01,69.8 72.01,71.09 72.69,71.78 72.69,73 72.01,73.69 C8.1 | 75.48,74.56 75.29,74.75 73.61,74.75 72.31,73.46 C8.1 | 75.48,74.56 75.51,74.52 75.51,72.31 74.75,71.55 74.52,71.55 U5.3 | C21.2 36.04,60.81 38.94,60.81 R31.2 | v41.07,60.73 41.99,60.73 R33.2 | 39.32,60.73 39.01,60.73 R31.2 | 39.32,60.73 v40.01,60.73 | U3.3 43.05,68.66 43.05,69.04 43.59,69.57 44.81,69.57 45.95,70.71 C22.2 | C22.2 45.72,70.56 44.27,72.01 42.75,72.01 42.52,71.78 42.52,71.4 U3.9 42.44,71.32 42.44,70.94 42.22,70.71 40.01,70.71 C16.2 40.01,70.64 39.36,69.99 | 39.32,60.73 39.32,69.95 39.36,69.99 | 39.32,60.73 R31.2 | v44.96,60.81 45.8,60.81 | C3.1 48.77,19.05 52.2,19.05 C1.2 52.27,19.05 52.96,19.74 54.18,19.74 54.48,19.43 54.48,15.54 50.6,11.66 50.6,6.33 | 50.6,6.33 50.6,5.33 SDCARD.4 | R19.1 84.2,6.02 84.2,7.24 80.39,11.05 73.61,11.05 72.62,10.06 72.31,10.06 R18.2 72.16,9.98 69.8,9.98 62.79,2.97 43.28,2.97 42.06,4.19 ELECTRON.36 41.99,4.19 39.55,4.19 ELECTRON.@36 39.47,4.27 29.38,14.36 | v23.01,27.43 23.01,30.86 D7.2
  Top 0.152: 29.38,14.36 30.71,15.7 30.71,16.15 J3.1 | 29.38,14.36 23.77,8.76 21.72,8.76 21.57,8.91 21.57,10.13 18.67,13.03 18.67,18.06 IC2.5 | v50.06,6.33 50.6,6.33 | 39.36,69.99 39.32,70.03 38.63,70.03 36.58,72.08 13.18,72.08 10.29,74.98 2.9,74.98 2.59,74.68 2.59,67.13 4.04,65.68 CN1.1
  Bottom 0.152: v40.01,60.73 v41.07,60.73 41.15,60.81 v44.96,60.81 | J3.1 30.79,16.23 31.77,17.22 31.77,19.2 31.17,19.81 30.63,19.81 v23.01,27.43 23.01,44.88 4.12,63.78 4.12,65.61 CN1.1 | v50.06,6.33 44.12,6.33 42.06,4.27 ELECTRON.36
5V  (via drill 0.3)
  Top 0.152: 20.04,47.09 18.06,47.09 C11.1 | 20.04,47.09 21.95,47.09 C7.1 | 20.04,47.09 20.04,43.13 IC3.2 19.96,43.05 19.74,43.05 16.61,39.93 13.34,39.93 12.88,39.47 12.88,35.81 12.5,35.43 12.5,32.77 | 9.98,19.36 9.98,23.09 6.33,26.75 6.33,29.57 9.53,32.77 12.5,32.77 | 9.98,19.36 9.98,18.82 C5.1 | 12.5,32.77 15.85,32.77 19.96,36.88 IC3.4 | v11.96,18.75 12.57,19.36 13.34,19.36 IC2.3 | 9.98,19.36 v10.9,19.36 | ELECTRON.1 59.82,4.19 ELECTRON.@1
  Bottom 0.152: v10.9,19.36 11.51,18.75 v11.96,18.75 11.96,11.43 13.26,10.13 13.26,9.53 14.4,8.38 25.98,8.38 29.41,4.95 37.03,4.95 39.01,2.97 58.52,2.97 59.74,4.19 ELECTRON.1 | CN4.1 75.44,50.98 75.44,39.62 64.16,28.35 64.16,9.37 62.71,7.92 61.8,7.92 61.11,7.24 61.11,5.49 62.33,4.27 ELECTRON.@1
!RTC_INT
  Top 0.152: U8.3 46.56,56.31 46.86,56.31 47.09,56.54 47.09,61.95 46.56,62.48 46.56,65.53 47.09,66.06 50.14,66.06 52.96,63.25 R32.2 52.96,63.17 50.06,60.27 50.06,59.36 IC1.2
+12V
  Top 0.152: R1.2 26.98,35.74 22.71,35.74 18.06,31.09 C4.1 17.98,31.01 16.84,29.87 14.02,29.87 D8.C 13.95,29.87 13.79,30.02 9.07,30.02 D9.A 8.99,30.02 7.01,28.04 7.01,27.05 TP3.P$1 7.01,26.98 11.43,22.55 11.43,18.29 15.62,14.1 15.62,9.91 16.76,8.76 18.67,8.76 20.27,7.16 21.34,7.16 J1.9
BAT_BACKUP
  Top 0.152: D5.+ 53.03,69.34 53.03,65.91 62.03,56.92 62.03,55.24 BAT1.+
BUTTON1  (via drill 0.3)
  Top 0.152: R7.1 78.18,9.98 77.95,9.98 77.27,9.3 75.97,9.3 75.29,9.98 C14.2 75.21,10.06 73.84,10.06 R18.1 73.69,9.98 v68.81,5.11
  Bottom 0.152: v68.81,5.11 64.92,5.11 62.79,2.97 61.87,2.97 61.04,3.81 61.04,4.65 60.12,5.56 51.59,5.56 49.07,8.08 41.53,8.08 40.84,8.76 40.84,15.7 40.88,15.73 | 40.88,15.73 41.99,16.84 ELECTRON.31 | 40.88,15.73 39.78,16.84 39.55,16.84 ELECTRON.@31
CANA_EN
  Top 0.152: IC2.8 18.67,21.95 22.02,21.95 23.7,23.62 29.34,23.62 30.25,22.71 32,22.71 38.25,28.96 38.25,30.86 39.47,32.08 ELECTRON.@25 39.55,32.16 41.99,32.16 ELECTRON.25
CANA_RX  (via drill 0.3)
  Top 0.152: v15.62,18.14 13.41,18.14 IC2.4 | v27.36,22.33 34.75,22.33 ELECTRON.@27 39.55,27.05 41.99,27.05 ELECTRON.27
  Bottom 0.152: v15.62,18.14 23.16,18.14 v27.36,22.33
CANA_TX  (via drill 0.3)
  Top 0.152: v34.98,26.9 21.87,26.9 16.92,21.95 13.41,21.95 IC2.1 | ELECTRON.26 41.99,29.64 39.55,29.64 ELECTRON.@26
  Bottom 0.152: v34.98,26.9 36.8,26.9 39.47,29.57 ELECTRON.@26
COM1
  Top 0.152: CHANNEL1.2 92.89,21.79 80.92,21.79 79.78,22.94 72.85,22.94 70.94,21.03 RELAY1.1
COM2
  Top 0.152: CHANNEL2.2 92.81,40.77 80.92,40.77 79.78,41.91 72.85,41.91 70.94,40.01 RELAY2.1
GND  (via drill 0.3, 0.35)
  Top 0.152: C5.2 10.06,17.22 10.06,11.66 11.66,10.06 J1.1 11.73,9.98 14.4,9.98 J1.2 | ELECTRON.33 41.99,11.81 39.55,11.81 ELECTRON.@33 39.47,11.89 37.57,11.89 36.39,13.07 | D4.3 25.07,17.91 29.95,17.91 30.71,18.67 J3.2 30.79,18.67 36.39,13.07 | C3.2 47.17,18.97 47.17,16.23 47.09,16.15 SDCARD.G3 | C1.1 53.72,18.97 53.72,16.84 53.03,16.15 SDCARD.G4 52.96,16.15 48.46,16.15 | 48.46,16.15 47.17,16.15 SDCARD.G3 | SDCARD.6 48.39,5.03 47.78,4.42 45.8,4.42 45.11,5.11 45.11,5.56 SDCARD.G2 | 56.46,6.78 56.46,5.49 56.39,5.41 SDCARD.G1 56.31,5.33 55.4,4.42 48.92,4.42 48.39,4.95 SDCARD.6 | 56.46,6.78 56.46,11.35 SDCARD.CD1 | 48.46,16.15 48.46,5.33 SDCARD.6 | D13.- 91.75,2.97 91.36,2.97 90.68,2.29 89.46,2.29 88.77,2.97 D11.- 88.7,2.97 88.01,2.29 86.79,2.29 86.11,2.97 85.8,2.97 D10.- 85.72,2.97 85.34,2.97 84.66,2.29 83.82,2.29 81.23,4.88 81.23,9.75 80.24,10.74 79.25,10.74 78.98,10.48 | 78.98,10.48 79.02,10.44 79.02,7.16 79.7,6.48 K1.4 | 78.98,10.48 78.72,10.74 77.8,10.74 77.11,10.06 76.81,10.06 C14.1 | R11.2 66.06,26.21 66.06,24.08 Q1.2 66.06,24 v64.69,22.63 | ELECTRON.@2 62.33,6.78 59.82,6.78 ELECTRON.2 59.74,6.78 56.46,6.78 | 36.39,13.07 39.01,15.7 46.63,15.7 47.02,16.08 SDCARD.G3 | D12.- 3.28,74.22 3.28,69.04 6.63,65.68 CN1.2 6.71,65.61 6.71,61.19 17.98,49.91 17.98,49 C11.2 18.06,48.92 21.95,48.92 C7.2 22.02,48.84 22.02,48.62 22.67,47.97 | D8.A 13.95,34.21 13.95,38.94 C10.2 14.02,38.94 22.25,38.94 | 22.25,38.94 22.25,43.05 IC3.1 22.33,43.13 22.94,43.74 22.94,47.7 22.67,47.97 | 22.25,38.94 22.25,36.5 | 22.25,36.5 22.25,35.89 19.36,32.99 18.06,32.99 C4.2 | 22.25,36.5 27.43,36.5 27.74,36.2 27.74,32.31 26.98,31.55 26.98,31.32 R3.2 26.98,31.24 24.16,31.24 23.55,31.85 22.02,31.85 21.11,30.94 D7.1 21.03,30.86 20.57,30.86 12.04,22.33 12.04,21.49 12.88,20.65 13.34,20.65 IC2.2 13.41,20.57 13.95,20.57 16.61,17.91 v16.61,17.6
  Top 0.152: Q2.2 66.06,43.05 66.06,45.19 R13.1 66.14,45.19 66.75,45.19 67.59,46.02 68.43,46.02 75.44,53.03 75.44,53.95 CN5.1 75.51,54.03 75.51,58.83 | 75.51,58.83 76.81,58.83 78.64,60.66 U5.27 78.72,60.73 81.23,60.73 U5.28 81.31,60.73 83.74,60.73 U5.29 83.82,60.73 86.26,60.73 U5.30 86.33,60.73 87.48,60.73 88.92,62.18 v88.92,62.71 | 75.51,58.83 74.52,58.83 U5.9 74.45,58.83 74.22,58.83 73.46,59.59 73.46,61.8 74.45,62.79 74.45,67.67 U5.6 | U5.23 78.72,72.16 81.23,72.16 U5.24 81.31,72.16 83.74,72.16 U5.25 83.82,72.16 86.26,72.16 U5.26 86.33,72.16 v87.48,72.16 | v91.75,65.23 92.96,65.23 R24.1 | C18.1 48.77,62.94 48.77,59.59 49,59.36 IC1.3 49,59.28 49,57.84 47.7,56.54 47.7,55.63 46.48,54.41 41.53,54.41 39.24,56.69 39.01,56.69 C19.2 38.94,56.77 37.15,58.56 | 37.15,58.56 36.5,59.21 36.04,59.21 C21.1 35.97,59.28 33.3,59.28 33.26,59.32 | 33.26,59.32 31.05,61.53 | 31.05,61.53 28.65,63.93 28.27,63.93 R20.1 | 31.05,61.53 32.92,63.4 32.92,64.54 28.35,69.11 28.35,70.71 CN2.4 | 71.32,71.63 71.32,69.27 71.93,68.66 71.93,68.28 C6.2 71.93,68.2 v72.69,67.44 | 71.32,71.63 71.93,72.24 C8.2 | 71.32,71.63 BAT1.- 62.03,71.63 58.75,71.63 57.45,70.33 52.2,70.33 50.98,69.11 50.98,68.58 50.75,68.35 46.86,68.35 46.02,69.19 C22.1 45.95,69.27 43.74,69.27 43.51,69.04 43.51,68.66 U3.4 43.43,68.58 43.43,68.2 43.24,68.01 | 45.68,56.66 45.03,56.01 U8.9 | 45.68,56.66 45.72,56.69 46.48,56.69 U8.4 | 45.68,56.66 44.27,58.06 44.27,59.97 C12.2 44.27,60.05 44.27,61.34 45.49,62.56 45.49,65.46 44.88,66.06 43.28,66.06 | U3.1 41.99,68.66 40.54,68.66 40.01,69.19 C16.1 | U3.8 42.98,71.32 42.98,69.95 41.99,68.96 41.99,68.73 U3.1
  Top 0.152: 43.24,68.01 43.2,67.97 42.29,67.97 42.06,68.2 42.06,68.58 U3.1 | 43.28,66.06 43.28,67.97 43.24,68.01 | 43.28,66.06 43.28,63.02 C17.1 43.2,62.94 42.52,62.94 40.54,60.96 40.54,60.5 40.08,60.05 38.63,60.05 37.15,58.56 | 22.67,47.97 29.72,55.02 29.72,55.78 33.26,59.32
  Top 0.305: X3.3 X3.4 X3.5 X3.2 | X3.3 95.16,54.91 | C9.1 94.76,59.24 v95,59 95,55.07 X3.3
  Bottom 0.152: 19.85,14.36 24.16,18.67 30.71,18.67 J3.2 | 19.85,14.36 15.54,10.06 14.48,10.06 J1.2 | v64.69,22.63 64.69,9.07 64.66,9.03 | 64.66,9.03 62.41,6.78 ELECTRON.@2 | K1.4 79.7,6.48 74.52,6.48 72.01,8.99 64.69,8.99 64.66,9.03 | v88.92,62.71 91.4,65.19 | 91.4,65.19 91.44,65.23 v91.75,65.23 91.97,65 94,65 95,64 v95,59 | v87.48,72.16 87.48,69.11 91.4,65.19 | v72.69,67.44 75.44,64.69 75.44,54.03 CN5.1 | v16.61,17.6 19.85,14.36
  other vias: 49,55 57,55 73,44 77,26 91,14 27,29 22,25 20,15
  pour Top: -1,79 97,79 100,76 100,62 98,60 88,60 88,48 98,48 98,-2 99,-3 0,-3 -2,-1 -2,78
  pour Bottom: -1,79 97,79 100,76 100,62 98,60 88,60 88,48 98,48 98,-2 99,-3 0,-3 -2,-1 -2,78
GPS_1PPS  (via drill 0.3)
  Top 0.152: v88.7,17.68 88.7,6.02 R2.1 | v87.63,61.65 87.63,63.78 90.22,66.37 90.45,66.37 U5.16
  Bottom 0.152: v88.7,17.68 88.7,47.17 87.63,48.23 v87.63,61.65
GPS_RESET
  Top 0.152: U5.1 74.45,73.99 74.22,73.99 73.23,73 73.23,62.03 63.55,52.35 63.55,33.3 62.41,32.16 ELECTRON.@12 62.33,32.16 59.82,32.16 ELECTRON.12
GPS_RX  (via drill 0.3)
  Top 0.152: v88.54,73.99 90.45,73.99 U5.22 | ELECTRON.3 59.82,9.3 62.33,9.3 ELECTRON.@3
  Bottom 0.152: v88.54,73.99 85.04,70.48 85.04,62.56 76.58,54.1 76.58,53.11 75.59,52.12 74.6,52.12 63.86,41.38 63.86,10.74 62.41,9.3 ELECTRON.@3
GPS_TX  (via drill 0.3)
  Top 0.152: v75.74,71.25 87.33,71.25 88.85,72.77 90.45,72.77 U5.21 | ELECTRON.4 59.82,11.81 ELECTRON.@4
  Bottom 0.152: v75.74,71.25 65.15,60.66 65.15,43.13 63.55,41.53 63.55,13.03 62.41,11.89 ELECTRON.@4
HSPD_HI
  Top 0.152: 24,20.65 24,20.12 D4.2 24,20.65 | 24,20.65 24,22.94 TP1.P$1 | 24,20.65 18.67,20.65 IC2.7 18.59,20.57 18.06,20.57 17.22,19.74 17.22,10.06 J1.3
HSPD_LO
  Top 0.152: TP2.P$1 25.98,22.94 25.98,20.12 D4.1 25.91,20.04 24.99,19.13 23.47,19.13 23.24,19.36 22.78,19.36 | 22.78,19.36 18.67,19.36 IC2.6 | 22.78,19.36 22.78,10.06 J1.5
N$1
  Top 0.152: R7.2 79.78,9.98 79.78,8.08 80.92,6.93 80.92,3.28 79.78,2.13 K1.3
N$2  (via drill 0.3)
  Top 0.152: v88.16,63.25 89.15,63.25 89.46,62.94 89.46,62.18 90.22,61.42 90.45,61.42 U5.12
  Bottom 0.152: v88.16,63.25 86.33,63.25 78.03,54.94 78.03,54.03 CN5.2
N$4
  Top 0.152: R12.2 67.97,45.19 67.97,43.13 67.89,43.05 Q2.1
N$5
  Top 0.152: D3.A 67.06,35.59 67.06,37.19 R9.2 67.06,37.26 67.06,37.64 69.57,40.16 69.57,42.67 72.85,45.95 RELAY2.3
N$6
  Top 0.152: R8.1 67.06,19.81 67.06,21.95 Q1.3
N$7
  Top 0.152: D2.A 67.06,16.54 67.06,18.21 R8.2 67.06,18.29 67.06,18.67 69.57,21.18 69.57,23.7 72.85,26.98 RELAY1.3
N$8
  Top 0.152: R9.1 67.06,38.79 67.06,40.92 Q2.3
N$9
  Top 0.152: D11.+ 87.25,3.05 87.25,5.94 R2.2
N$10  (via drill 0.3)
  Top 0.152: D13.+ 90.3,3.05 90.3,4.5 91.75,5.94 R17.2 91.82,6.02 91.82,12.5 94.11,14.78 94.11,22.25 93.42,22.94 87.33,22.94 74.98,35.28 72.31,35.28 71.55,34.52 66.06,34.52 64.08,36.5 v64.08,48.08 | v10.29,74.22 4.8,74.22 D12.+
  Bottom 0.152: v10.29,74.22 11.05,74.22 13.18,72.08 49.15,72.08 60.96,60.27 60.96,51.21 v64.08,48.08
N$19
  Top 0.305: U5.10 90.5,57.5 91,57 92,57 93,56 93,52.59 X3.1
N$21  (via drill 0.3)
  Top 0.152: R6.2 93.04,63.78 93.04,64.08 93.73,64.77 93.73,67.51 93.04,68.2 R25.1 92.96,68.2 v92.2,68.96 | v89.23,68.96 74.52,68.96 U5.5
  Bottom 0.152: v92.2,68.96 v89.23,68.96
N$22  (via drill 0.3)
  Top 0.152: v91.75,62.18 92.96,62.18 R6.1 | v86.03,62.18 75.29,62.18 74.52,61.42 U5.7
  Bottom 0.152: v86.03,62.18 v91.75,62.18
N$23
  Top 0.152: R10.2 67.97,26.21 67.97,24.16 67.89,24.08 Q1.1
N$24
  Top 0.152: R21.2 33.83,64.01 33.83,68.66 CN2.1
N$26
  Top 0.152: R24.2 92.96,66.83 91.59,66.83 90.75,67.67 90.53,67.67 U5.17
N$27
  Top 0.152: R25.2 92.96,69.72 91.52,69.72 90.83,69.04 90.53,69.04 U5.18
N$29
  Top 0.152: D10.+ 84.28,3.05 84.28,4.5 85.72,5.94 R19.2
N$40
  Top 0.152: U8.2 46.56,55.78 46.86,55.78 47.4,56.31 47.4,62.79 47.24,62.94 C18.2 47.24,63.02 47.47,63.25 47.47,65 X4.1
N$41
  Top 0.152: U8.1 46.48,55.24 45.87,55.24 45.34,54.71 41.83,54.71 41.53,55.02 41.53,57.15 43.51,59.13 43.51,61.72 44.73,62.94 C17.2 44.73,63.02 44.5,63.25 44.5,65 X4.2
N$43
  Top 0.152: D9.C 9.07,33.98 12.04,36.96 12.04,38.94 C10.1 12.12,39.01 12.12,39.17 16,43.05 17.68,43.05 IC3.3
N$49  (via drill 0.3)
  Top 0.152: v42.06,55.24 43.43,55.24 U8.8 | v39.93,55.24 39.01,55.24 C19.1 | D5.- 52.96,72.69 50.06,72.69 D6.- 49.99,72.62 v48.92,71.55
  Bottom 0.152: v39.93,55.24 v42.06,55.24 42.06,55.55 48.92,62.41 v48.92,71.55
NC1
  Top 0.152: CHANNEL1.1 92.89,25.22 86.87,25.22 85.11,26.98 RELAY1.5
NC2
  Top 0.152: CHANNEL2.1 92.81,44.27 86.79,44.27 85.11,45.95 RELAY2.5
NO1
  Top 0.152: CHANNEL1.3 92.89,18.21 88.32,18.21 85.11,15.01 RELAY1.4
NO2
  Top 0.152: CHANNEL2.3 92.81,37.19 88.24,37.19 85.11,34.06 RELAY2.4
ONOFF
  Top 0.152: U5.4 74.52,70.26 90.45,70.26 U5.19
RELAY1
  Top 0.152: R10.1 67.97,27.81 66.06,27.81 R11.1 65.99,27.81 63.25,27.81 62.79,28.27 59.28,28.27 58.14,27.13 58.14,21.03 57.99,20.88 43.13,20.88 42.06,21.95 ELECTRON.29 41.99,22.02 39.55,22.02 ELECTRON.@29
RELAY2  (via drill 0.3)
  Top 0.152: R12.1 67.97,46.79 66.06,46.79 R13.2 65.99,46.79 v64.62,46.79 | ELECTRON.@30 39.55,19.43 41.99,19.43 ELECTRON.30
  Bottom 0.152: v64.62,46.79 60.27,51.13 43.97,51.13 43.2,50.37 43.2,20.65 42.06,19.51 ELECTRON.30
RFIDTX
  Top 0.152: ELECTRON.@28 39.55,24.54 41.99,24.54 ELECTRON.28 | R21.1 29.79,64.01 R20.2 29.72,64.01 29.41,64.01 28.73,64.69 17.37,64.69 17.22,64.54 10.29,64.54 9.22,65.61 CN1.3
  Bottom 0.152: ELECTRON.@28 39.47,24.54 36.58,24.54 23.32,37.8 23.32,51.51 9.22,65.61 CN1.3
RTC_INT
  Top 0.152: IC1.4 49.07,56.69 49.76,56.69 55.32,51.13 57.99,51.13 58.6,50.52 58.6,31.62 59.44,30.79 66.14,30.79 68.73,28.19 68.73,27.28 68.43,26.98 67.59,26.98 66.9,26.29 66.9,23.32 63.86,20.27 63.86,15.85 62.41,14.4 ELECTRON.@5 62.33,14.4 59.82,14.4 ELECTRON.5
SCL  (via drill 0.3)
  Top 0.152: v42.06,56.31 43.43,56.31 U8.6 | v40.08,58.29 39.93,58.29 39.01,59.21 R31.1 | v44.73,70.64 44.04,71.32 U3.6
  Bottom 0.152: v40.08,58.29 41.11,57.26 | 41.11,57.26 v42.06,56.31 42.06,56.39 42.29,56.39 45.49,59.59 45.49,61.04 44.73,61.8 v44.73,70.64 | 41.11,57.26 39.4,55.55 39.4,55.02 40.69,53.72 40.69,24 40.01,23.32 39.09,23.32 37.11,21.34 30.79,21.34 J3.3
SD_CS
  Top 0.152: SDCARD.2 52.81,5.33 52.81,9.14 59.36,15.7 62.87,15.7 63.55,16.38 63.55,25.91 62.41,27.05 ELECTRON.@10 59.82,27.05 ELECTRON.10
SD_DETECT
  Top 0.152: SDCARD.CD2 56.54,15.16 58.06,15.16 59.74,16.84 ELECTRON.6 59.82,16.92 62.33,16.92 ELECTRON.@6
SDA  (via drill 0.3)
  Top 0.152: v42.67,57.53 43.43,56.77 U8.5 | v41.91,58.29 41.91,59.13 41.99,59.21 R33.1 | v43.51,70.1 43.51,71.32 U3.7 | v37.95,56.92 37.95,29.11 32.69,23.85 30.79,23.85 J3.4
  Bottom 0.152: v42.67,57.53 v41.91,58.29 41.68,58.29 40.5,59.47 | v43.51,70.1 43.51,65 39.47,60.96 39.47,60.5 40.5,59.47 | 40.5,59.47 v37.95,56.92
SPI_MISO  (via drill 0.3)
  Top 0.152: v47.32,9.45 47.32,5.33 SDCARD.7 | ELECTRON.@8 62.33,22.02 59.82,22.02 ELECTRON.8
  Bottom 0.152: v47.32,9.45 59.82,21.95 ELECTRON.8
SPI_MOSI
  Top 0.152: SDCARD.3 51.74,5.33 51.74,11.81 59.36,19.43 59.74,19.43 ELECTRON.7 59.82,19.43 ELECTRON.@7
SPI_SCK  (via drill 0.3)
  Top 0.152: v49.53,10.9 49.53,5.33 SDCARD.5
  Bottom 0.152: v49.53,10.9 59.44,20.8 60.35,20.8 61.04,21.49 61.04,23.24 61,23.28 | 61,23.28 59.82,24.46 ELECTRON.9 | 61,23.28 62.18,24.46 62.33,24.46 ELECTRON.@9
STATUSLED
  Top 0.152: R17.1 90.22,5.94 89.92,5.94 89.23,5.26 88.32,5.26 87.94,5.64 87.94,6.48 83.06,11.35 68.66,11.35 62.71,5.41 58.22,5.41 56.92,4.12 44.65,4.12 43.2,5.56 43.2,13.18 42.06,14.33 ELECTRON.32 41.99,14.4 39.55,14.4 ELECTRON.@32
VBAT  (via drill 0.3)
  Top 0.152: ELECTRON.11 59.82,29.64 62.33,29.64 ELECTRON.@11 | 27.05,33.15 27.05,34.21 R1.1 | 27.05,33.15 27.05,32.77 R3.1 | 27.05,33.15 22.02,33.15 D7.3 | 27.05,33.15 R3.1 | v26.21,31.93 26.98,32.69 R3.1 | v36.27,13.95 v36.27,21.87 | ELECTRON.34 41.99,9.3 39.55,9.3 ELECTRON.@34
  Bottom 0.152: v36.27,21.87 v26.21,31.93 | v36.27,13.95 36.27,12.5 39.47,9.3 ELECTRON.@34 | ELECTRON.11 59.74,29.57 59.74,28.73 58.14,27.13 58.14,21.03 46.41,9.3 42.06,9.3 ELECTRON.34
VRELAY
  Top 0.152: D2.C 67.06,13.49 71.4,13.49 72.85,14.94 RELAY1.2 | D3.C 67.06,32.54 71.4,32.54 72.85,33.98 RELAY2.2
  Bottom 0.152: CN4.2 77.95,50.98 77.95,41.68 72.92,36.65 72.92,34.06 RELAY2.2 72.85,33.98 71.55,32.69 71.55,26.52 72.85,25.22 72.85,15.01 RELAY1.2

### Text on the board
Document: 3.3V | +5V | GND | TX | WINDSCREEN | 3.3V | GND | TX | RDM6300 | 125kHZ RFID / SEEED SKU / 113990041 | I2C Header | Sub-D 9 to OBD-II
silktop: Ant | Int. | Ext | VRelay | 5V | 3.3V | 18 pin / 2.54mm / female / headers | J.Devine '17 | Licensed under / CERN OHL V1.2 | https://github.com/ / pingud98/Open_Auto | P1 | P2 | Open / Auto / V1.2